# EasyEDA Pro project ECU_Project.epro, schematic ECU
Board Name: Embedded; Create Date: 2024-12-12; Page Name: Schematic; Project Name: ECU; Schematic Name: ECU; Update Date: 2025-01-06; Company: ProjectKita; Drawn: Yunus; Page Size: A2; Part Number: JLCPCB-002; Reviewed: Aris; Version: V1.2
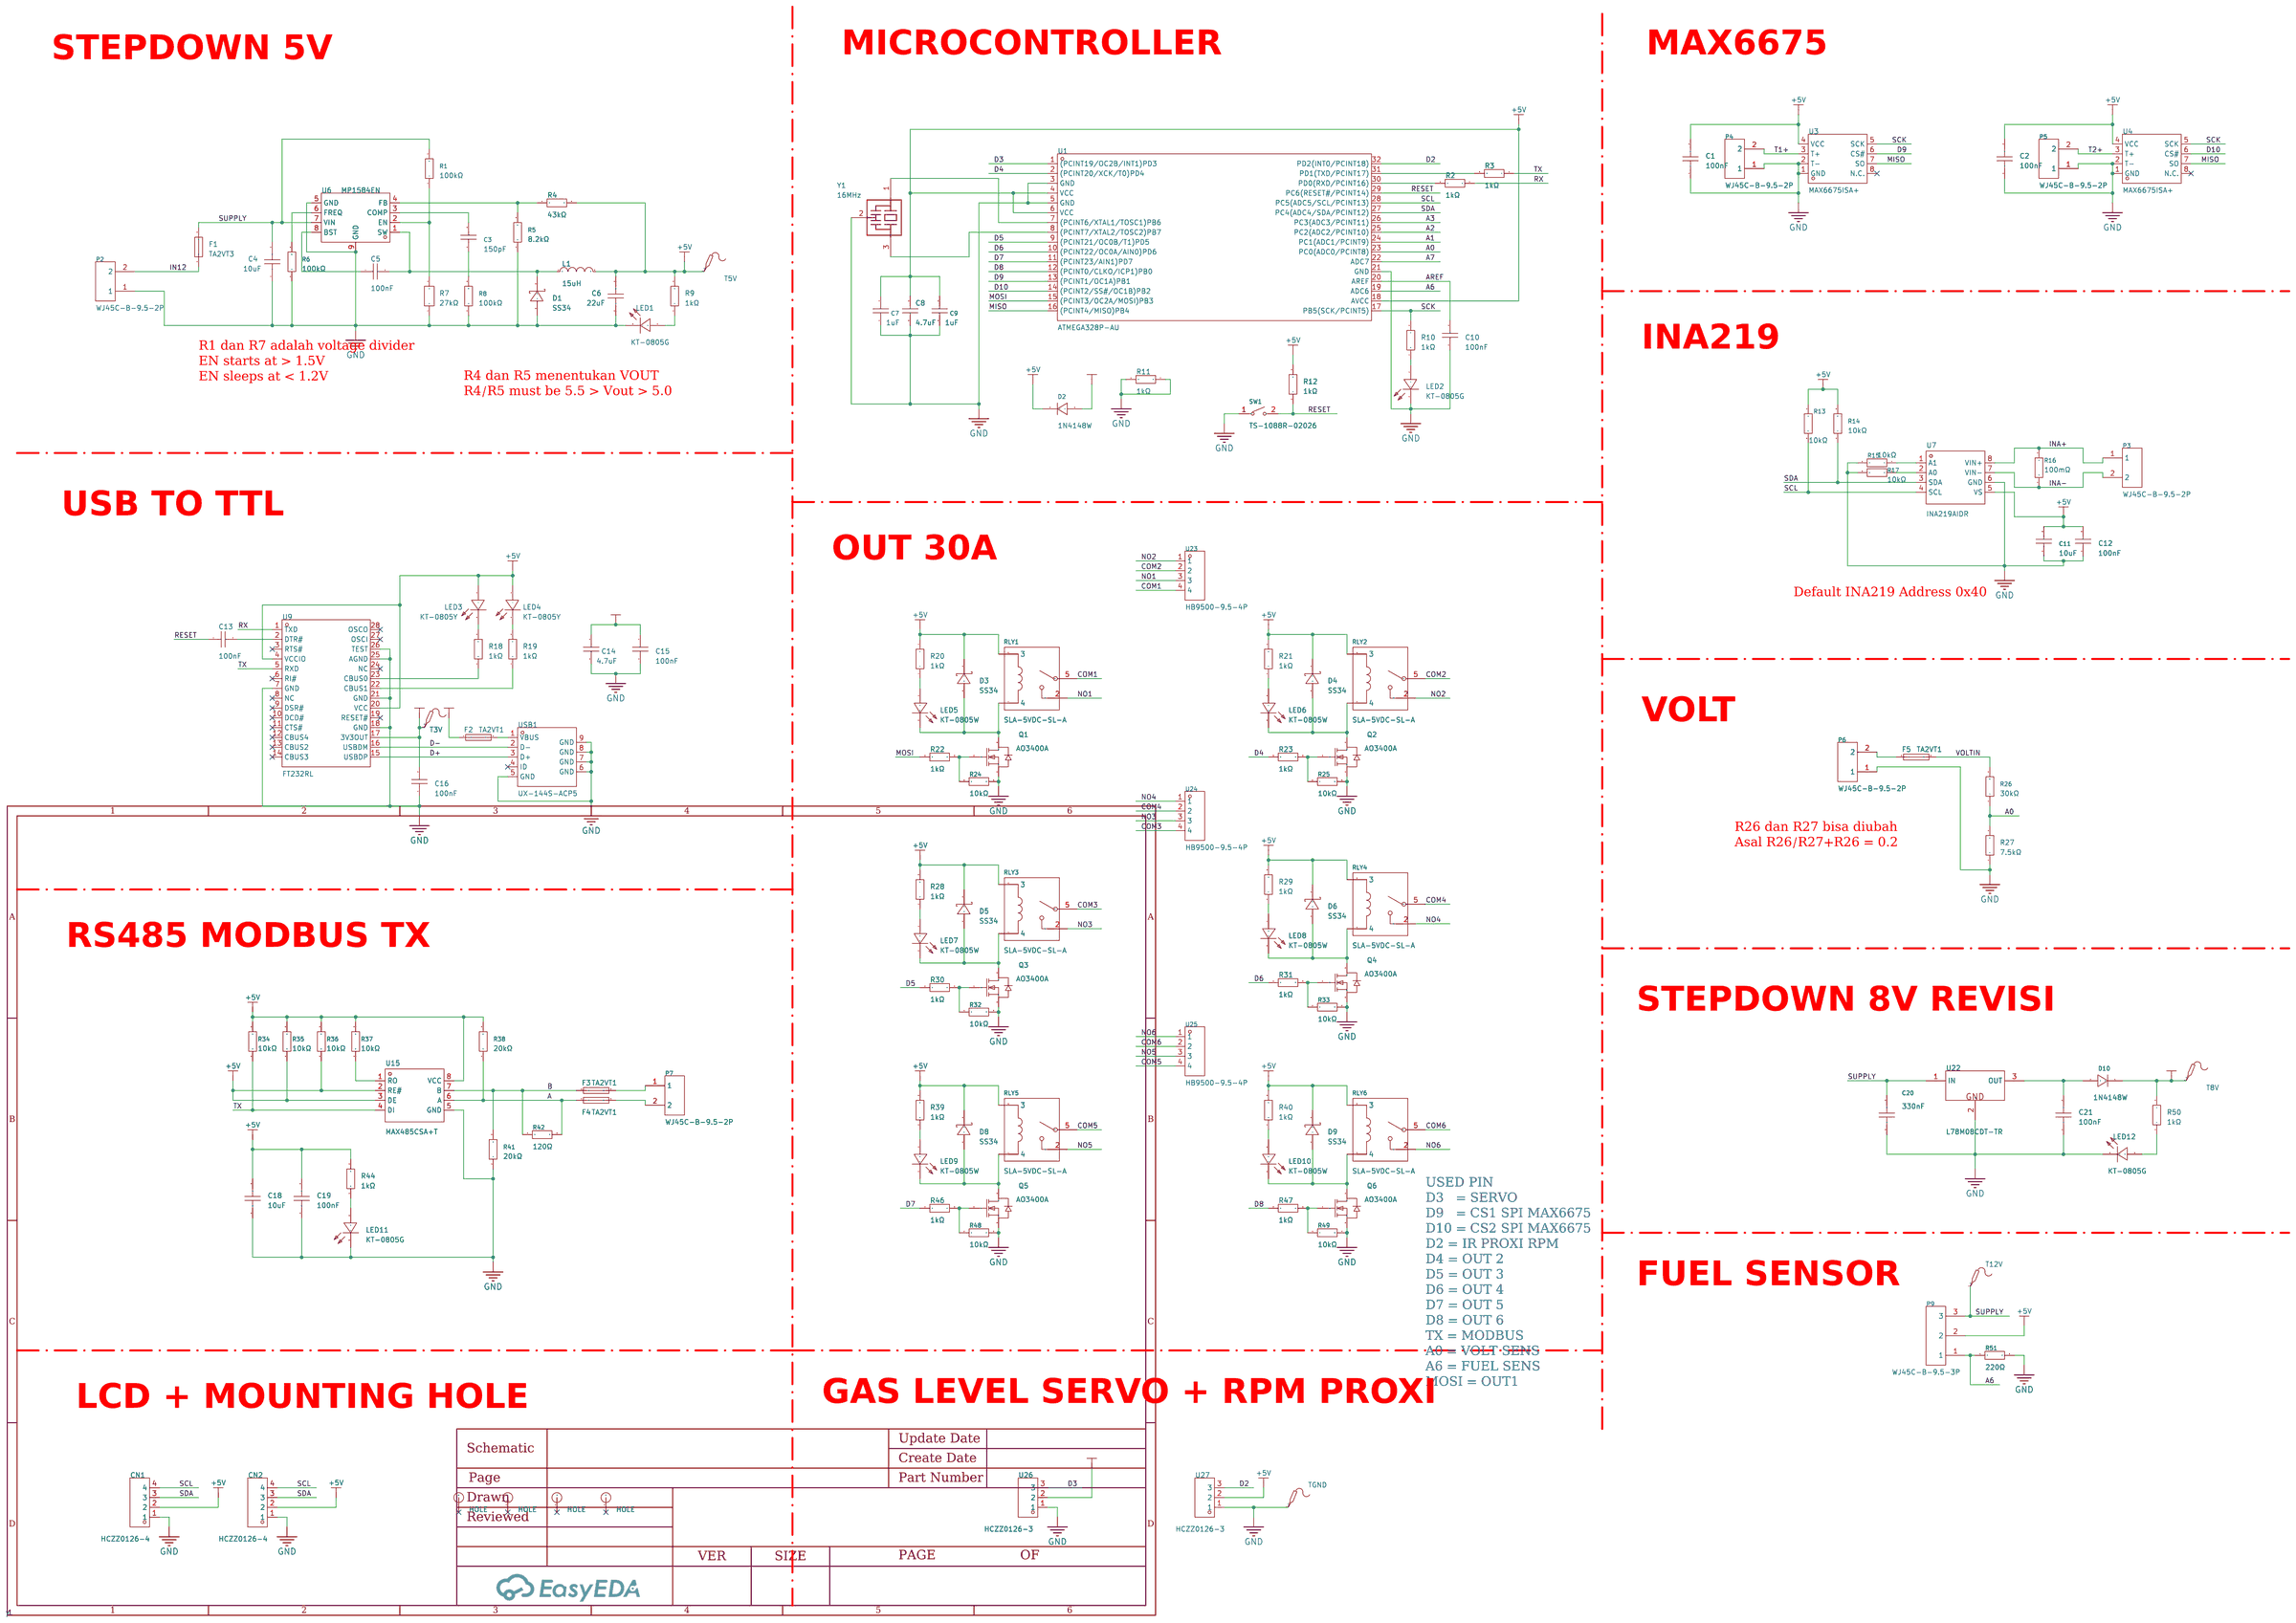
[diagram p0: schematic sheet]

## Parts
C1  100nF  [C0805]
C2  100nF  [C0805]
C3  150pF  [C0805]
C4  10uF  [C0805]
C5  100nF  [C0805]
C6  22uF  [C0805]
C7  1uF  [C0805]
C8  4.7uF  [C0805]
C9  1uF  [C0805]
C10  100nF  [C0805]
C11  10uF  [C0805]
C12  100nF  [C0805]
C13  100nF  [C0805]
C14  4.7uF  [C0805]
C15  100nF  [C0805]
C16  100nF  [C0805]
C18  10uF  [C0805]
C19  100nF  [C0805]
C20  330nF  [C0805]
C21  100nF  [C0805]
CN1  HCZZ0126-4  [CONN-TH_XH2.54-4P]
CN2  HCZZ0126-4  [CONN-TH_XH2.54-4P]
D1  SS34  [SMA_L4.3-W2.6-LS5.2-RD]
D2  1N4148W  [SOD-123F_L2.7-W1.6-LS3.8-RD]
D3  SS34  [SMA_L4.3-W2.6-LS5.2-RD]
D4  SS34  [SMA_L4.3-W2.6-LS5.2-RD]
D5  SS34  [SMA_L4.3-W2.6-LS5.2-RD]
D6  SS34  [SMA_L4.3-W2.6-LS5.2-RD]
D8  SS34  [SMA_L4.3-W2.6-LS5.2-RD]
D9  SS34  [SMA_L4.3-W2.6-LS5.2-RD]
D10  1N4148W  [SOD-123F_L2.7-W1.6-LS3.8-RD]
F1  TA2VT3  [FUSE-SMD_L6.1-W2.5]
F2  TA2VT1  [F2410]
F3  TA2VT1  [F2410]
F4  TA2VT1  [F2410]
F5  TA2VT1  [F2410]
J1  HOLE  [M2 Mounting Hole - Conductive]
J2  HOLE  [M2 Mounting Hole - Conductive]
J3  HOLE  [M2 Mounting Hole - Conductive]
J4  HOLE  [M2 Mounting Hole - Conductive]
L1  15uH  [IND-SMD_L7.0-W6.6_FXL0630]
LED1  KT-0805G  [LED0805-R-RD]
LED2  KT-0805G  [LED0805-R-RD]
LED3  KT-0805Y  [LED0805-R-RD]
LED4  KT-0805Y  [LED0805-R-RD]
LED5  KT-0805W  [LED0805-R-RD]
LED6  KT-0805W  [LED0805-R-RD]
LED7  KT-0805W  [LED0805-R-RD]
LED8  KT-0805W  [LED0805-R-RD]
LED9  KT-0805W  [LED0805-R-RD]
LED10  KT-0805W  [LED0805-R-RD]
LED11  KT-0805G  [LED0805-R-RD]
LED12  KT-0805G  [LED0805-R-RD]
P2  WJ45C-B-9.5-2P  [CONN-TH_2P-P9.50_WJ45C-B-2P]
P3  WJ45C-B-9.5-2P  [CONN-TH_2P-P9.50_WJ45C-B-2P]
P4  WJ45C-B-9.5-2P  [CONN-TH_2P-P9.50_WJ45C-B-2P]
P5  WJ45C-B-9.5-2P  [CONN-TH_2P-P9.50_WJ45C-B-2P]
P6  WJ45C-B-9.5-2P  [CONN-TH_2P-P9.50_WJ45C-B-2P]
P7  WJ45C-B-9.5-2P  [CONN-TH_2P-P9.50_WJ45C-B-2P]
P9  WJ45C-B-9.5-3P  [CONN-TH_3P-P9.50_WJ45C-B-3P]
Q1  AO3400A  [SOT-23-3_L2.9-W1.3-P1.90-LS2.4-BR]
Q2  AO3400A  [SOT-23-3_L2.9-W1.3-P1.90-LS2.4-BR]
Q3  AO3400A  [SOT-23-3_L2.9-W1.3-P1.90-LS2.4-BR]
Q4  AO3400A  [SOT-23-3_L2.9-W1.3-P1.90-LS2.4-BR]
Q5  AO3400A  [SOT-23-3_L2.9-W1.3-P1.90-LS2.4-BR]
Q6  AO3400A  [SOT-23-3_L2.9-W1.3-P1.90-LS2.4-BR]
R1  100kΩ  [R0805]
R2  1kΩ  [R0805]
R3  1kΩ  [R0805]
R4  43kΩ  [R0805]
R5  8.2kΩ  [R0805]
R6  100kΩ  [R0805]
R7  27kΩ  [R0805]
R8  100kΩ  [R0805]
R9  1kΩ  [R0805]
R10  1kΩ  [R0805]
R11  1kΩ  [R0805]
R12  1kΩ  [R0805]
R13  10kΩ  [R0805]
R14  10kΩ  [R0805]
R15  10kΩ  [R0805]
R16  100mΩ  [R1206]
R17  10kΩ  [R0805]
R18  1kΩ  [R0805]
R19  1kΩ  [R0805]
R20  1kΩ  [R0805]
R21  1kΩ  [R0805]
R22  1kΩ  [R0805]
R23  1kΩ  [R0805]
R24  10kΩ  [R0805]
R25  10kΩ  [R0805]
R26  30kΩ  [R0805]
R27  7.5kΩ  [R0805]
R28  1kΩ  [R0805]
R29  1kΩ  [R0805]
R30  1kΩ  [R0805]
R31  1kΩ  [R0805]
R32  10kΩ  [R0805]
R33  10kΩ  [R0805]
R34  10kΩ  [R0805]
R35  10kΩ  [R0805]
R36  10kΩ  [R0805]
R37  10kΩ  [R0805]
R38  20kΩ  [R0805]
R39  1kΩ  [R0805]
R40  1kΩ  [R0805]
R41  20kΩ  [R0805]
R42  120Ω  [R0805]
R44  1kΩ  [R0805]
R46  1kΩ  [R0805]
R47  1kΩ  [R0805]
R48  10kΩ  [R0805]
R49  10kΩ  [R0805]
R50  1kΩ  [R0805]
R51  220Ω  [R0805]
RLY1  SLA-5VDC-SL-A  [RELAY-TH_SLA-XXVDC-SL-A]
RLY2  SLA-5VDC-SL-A  [RELAY-TH_SLA-XXVDC-SL-A]
RLY3  SLA-5VDC-SL-A  [RELAY-TH_SLA-XXVDC-SL-A]
RLY4  SLA-5VDC-SL-A  [RELAY-TH_SLA-XXVDC-SL-A]
RLY5  SLA-5VDC-SL-A  [RELAY-TH_SLA-XXVDC-SL-A]
RLY6  SLA-5VDC-SL-A  [RELAY-TH_SLA-XXVDC-SL-A]
SW1  TS-1088R-02026  [SW-SMD_L3.9-W3.0-P4.45]
T3V  -  [Test-Point-0.5mm]
T5V  -  [Test-Point-0.5mm]
T8V  -  [Test-Point-0.5mm]
T12V  -  [Test-Point-0.5mm]
TGND  -  [Test-Point-0.5mm]
U1  ATMEGA328P-AU  [TQFP-32_L7.0-W7.0-P0.80-LS9.0-BL]
U3  MAX6675ISA+  [SOIC-8_L5.0-W4.0-P1.27-LS6.0-BL]
U4  MAX6675ISA+  [SOIC-8_L5.0-W4.0-P1.27-LS6.0-BL]
U6  MP1584EN  [SOIC-8_L4.9-W3.9-P1.27-LS6.0-BL-EP3.3]
U7  INA219AIDR  [SOIC-8_L4.9-W3.9-P1.27-LS6.0-BL]
U9  FT232RL  [SSOP-28_L10.2-W5.3-P0.65-LS7.8-BL]
U15  MAX485CSA+T  [SOIC-8_L4.9-W3.9-P1.27-LS6.0-BL]
U22  L78M08CDT-TR  [TO-252-2_L6.6-W6.1-P4.57-LS9.9-TL-CW]
U23  HB9500-9.5-4P  [CONN-TH_HB9500-9.5-4P]
U24  HB9500-9.5-4P  [CONN-TH_HB9500-9.5-4P]
U25  HB9500-9.5-4P  [CONN-TH_HB9500-9.5-4P]
U26  HCZZ0126-3  [CONN-TH_3P-P2.50_3PIN]
U27  HCZZ0126-3  [CONN-TH_3P-P2.50_3PIN]
USB1  UX-144S-ACP5  [MINI-USB-SMD_UX-144S-ACP5]
Y1  16MHz  [OSC-SMD_3P-L3.2-W1.3-P1.2-L]

## Library data of the parts
C1 C2 = CC0805KRX7R9BB104: Capacitance: Tolerance:±10% Tolerance:±10% Voltage Rated: Temperature Coefficient:; LCSC Part Name: 100nF ±10% 50V; Supplier Part: C49678; Manufacturer: YAGEO(国巨); Supplier Footprint: 0805; Datasheet: https://atta.szlcsc.com/upload/public/pdf/source/20180224/C181747_15194369449651363981.pdf; Supplier: LCSC; Tolerance: ±10%
C3 = CC0805JRNPO9BN151: Capacitance: Tolerance:±5% Tolerance:±5% Voltage Rated: Temperature Coefficient:; LCSC Part Name: 150pF ±5% 50V; Supplier Part: C107111; Manufacturer: YAGEO(国巨); Supplier Footprint: 0805; Datasheet: https://atta.szlcsc.com/upload/public/pdf/source/20170914/C128857_1505359892143968080.pdf; Supplier: LCSC; Tolerance: ±5%
C4 = CL21A106KBYQNNE: Capacitance: Tolerance:±10% Tolerance:±10% Voltage Rated: Temperature Coefficient:; LCSC Part Name: 10uF ±10% 50V; Supplier Part: C2932476; Manufacturer: SAMSUNG(三星); Supplier Footprint: 0805; JLCPCB Part Class: Extended Part; Datasheet: https://atta.szlcsc.com/upload/public/pdf/source/20211217/EA547804C3DC63CB0E92325AB8B6CF61.pdf; Supplier: LCSC; Tolerance: ±10%
C5 = CL21B104KBCNNNC: Capacitance: Tolerance:±10% Tolerance:±10% Voltage Rated: Temperature Coefficient:; LCSC Part Name: 100nF ±10% 50V; Supplier Part: C1711; Manufacturer: SAMSUNG(三星); Supplier Footprint: 0805; JLCPCB Part Class: Extended Part; Datasheet: https://atta.szlcsc.com/upload/public/pdf/source/20160218/1457707763339.pdf; Supplier: LCSC; Tolerance: ±10%
C6 = CL21A226MQQNNNE: Capacitance: Tolerance:±20% Tolerance:±20% Voltage Rated: Temperature Coefficient:; LCSC Part Name: 22uF ±20% 6.3V; Supplier Part: C5674; Manufacturer: SAMSUNG(三星); Supplier Footprint: 0805; JLCPCB Part Class: Extended Part; Datasheet: https://atta.szlcsc.com/upload/public/pdf/source/20160218/1457707763339.pdf; Supplier: LCSC; Tolerance: ±20%
C7 C9 = CL21B105KBFNNNE: Capacitance: Tolerance:±10% Tolerance:±10% Voltage Rated: Temperature Coefficient:; LCSC Part Name: 1uF ±10% 50V; Supplier Part: C28323; Manufacturer: SAMSUNG(三星); Supplier Footprint: 0805; JLCPCB Part Class: Basic Part; Datasheet: https://atta.szlcsc.com/upload/public/pdf/source/20160218/1457707763339.pdf; Supplier: LCSC; Tolerance: ±10%
C8 C14 = CL21B475KOFNNNE: Capacitance: Tolerance:±10% Tolerance:±10% Voltage Rated: Temperature Coefficient:; LCSC Part Name: 4.7uF ±10% 16V; Supplier Part: C107365; Manufacturer: SAMSUNG(三星); Supplier Footprint: 0805; JLCPCB Part Class: Extended Part; Datasheet: https://atta.szlcsc.com/upload/public/pdf/source/20160218/1457707763339.pdf; Supplier: LCSC; Tolerance: ±10%
C10 C12 C13 C15 C16 = CL21B104KCFNNNE: Capacitance: Tolerance:±10% Tolerance:±10% Voltage Rated: Temperature Coefficient:; LCSC Part Name: 100nF ±10% 100V; Supplier Part: C28233; Manufacturer: SAMSUNG(三星); Supplier Footprint: 0805; JLCPCB Part Class: Basic Part; Datasheet: https://atta.szlcsc.com/upload/public/pdf/source/20160218/1457707763339.pdf; Supplier: LCSC; Tolerance: ±10%
C11 = CL21A106KPFNNNE: Capacitance: Tolerance:±10% Tolerance:±10% Voltage Rated: Temperature Coefficient:; LCSC Part Name: 10uF ±10% 10V; Supplier Part: C17024; Manufacturer: SAMSUNG(三星); Supplier Footprint: 0805; Datasheet: https://atta.szlcsc.com/upload/public/pdf/source/20160218/1457707763339.pdf; Supplier: LCSC; Tolerance: ±10%
C18 = CL21A106KAYNNNE_C15850: Capacitance: Tolerance:±10% Tolerance:±10% Voltage Rated: Temperature Coefficient:; LCSC Part Name: 10uF ±10% 25V; Supplier Part: C15850; Manufacturer: SAMSUNG(三星); Manufacturer Part: CL21A106KAYNNNE; Supplier Footprint: 0805; JLCPCB Part Class: Basic Part; Datasheet: https://atta.szlcsc.com/upload/public/pdf/source/20160218/1457707763339.pdf; Supplier: LCSC; Tolerance: ±10%
C19 = CC0805KRX7R9BB104: Capacitance: Tolerance:±10% Tolerance:±10% Voltage Rated: Temperature Coefficient:; LCSC Part Name: 100nF ±10% 50V; Supplier Part: C49678; Manufacturer: YAGEO(国巨); Supplier Footprint: 0805; JLCPCB Part Class: Basic Part; Datasheet: https://atta.szlcsc.com/upload/public/pdf/source/20180224/C181747_15194369449651363981.pdf; Supplier: LCSC; Tolerance: ±10%
C20 = CL21B334KOCNNNC: Capacitance: Tolerance:±10% Tolerance:±10% Voltage Rated: Temperature Coefficient:; LCSC Part Name: 330nF ±10% 16V; Supplier Part: C318723; Manufacturer: SAMSUNG(三星); Supplier Footprint: 0805; Datasheet: https://atta.szlcsc.com/upload/public/pdf/source/20160218/1457707763339.pdf; Supplier: LCSC; Tolerance: ±10%
C21 = GRM21B7U1A104JA01L: Capacitance: Tolerance:±5% Tolerance:±5% Voltage Rated: Temperature Coefficient:; LCSC Part Name: 100nF ±5% 10V; Supplier Part: C710980; Manufacturer: muRata(村田); Supplier Footprint: 0805; Datasheet: https://atta.szlcsc.com/upload/public/pdf/source/20210128/C710980_BEF80F3D26E955AEFCD9E2DE324B32E9.pdf; Supplier: LCSC; Tolerance: ±5%
CN1 CN2 = HCZZ0126-4: Pins Structure:1x4P Pitch:2.54mm Mounting Style:Straight Reference Series:XH Number of Pins:4P Number of Rows:1 Number of PINs Per Row:4 Current Rating (Max):3A Contact Material:Brass Contact Plating:Tin Operating Temperature Range:-25℃~+85℃ Operating Tem; LCSC Part Name: 1x4P 间距:2.54mm 直插 系列:XH 米色; Supplier Part: C7433754; Manufacturer: HC(虹成电子); Supplier Footprint: 插件,p=2.54mm; Datasheet: https://atta.szlcsc.com/upload/public/pdf/source/20230707/95864C323290A0568648B2D8A0D96E5C.pdf; Supplier: LCSC; Pins Structure: 1x4P; Pitch: 2.54mm; Mounting Style: Straight; Reference Series: XH; Number of Pins: 4P; Number of Rows: 1; Number of PINs Per Row: 4; Current Rating (Max): 3A; Contact Material: Brass; Contact Plating: Tin; Operating Temperature Range: -25℃~+85℃
D1 D3-D6 D8 D9 = SS34_C8678: Diode Configuration:Independent Type Forward Voltage (Vf@If):550mV@3A Reverse Voltage (Vr):40V Rectified Current:3A Reverse Leakage Current (Ir):500uA@40V; LCSC Part Name: 电压:40V 电流:3A; Supplier Part: C8678; Manufacturer: MDD(辰达半导体); Supplier Footprint: SMA(DO-214AC); JLCPCB Part Class: Basic Part; Datasheet: https://atta.szlcsc.com/upload/public/pdf/source/20240710/2118BB86FDDB2E0B294389AC1F3F65C8.pdf; Supplier: LCSC; Diode Configuration: Independent Type; Forward Voltage (Vf@If): 550mV@3A; Reverse Voltage (Vr): 40V; Rectified Current: 3A; Reverse Leakage Current (Ir): 500uA@40V
D2 D10 = 1N4148W_C81598: Diode Configuration: Forward Voltage (Vf@If):1V@50mA Reverse Voltage (Vr): Average Rectified Current (Io): Power Dissipation: Reverse Leakage Current:1uA@75V Reverse Recovery Time (trr): Operating Temperature:- Operating Temperature:-; LCSC Part Name: 电压:75V 电流:150mA; Supplier Part: C81598; Manufacturer: ST(先科); Supplier Footprint: SOD-123; JLCPCB Part Class: Basic Part; Datasheet: https://atta.szlcsc.com/upload/public/pdf/source/20161024/1477288446905.pdf; Supplier: LCSC; Forward Voltage (Vf@If): 1V@50mA; Reverse Leakage Current: 1uA@75V
F1 = TA2VT3: Type:SMD Fuse Current Rating:3A Voltage Rating  (AC):250V; LCSC Part Name: 2410 慢断 3A 250V 镀金; Supplier Part: C3014121; Manufacturer: TLC(竞沃); Supplier Footprint: 2410; JLCPCB Part Class: Extended Part; Datasheet: https://atta.szlcsc.com/upload/public/pdf/source/20220520/442597D85C5DD0BE46CC46EDD38271F0.pdf; Supplier: LCSC; Type: SMD Fuse; Current Rating: 3A; Voltage Rating  (AC): 250V
F2-F5 = TA2VT1: LCSC Part Name: 2410 慢断 1A 250V 镀金; Supplier Part: C3014117; Manufacturer: TLC(竞沃); Supplier Footprint: 2410; JLCPCB Part Class: Extended Part; Datasheet: https://atta.szlcsc.com/upload/public/pdf/source/20220520/442597D85C5DD0BE46CC46EDD38271F0.pdf; Supplier: LCSC
J1-J4 = HOLE
L1 = FXL0630-150-M: Inductance: Tolerance:±20% Tolerance:±20% Rated Current:3A Saturation Current (Isat):4.5A DC Resistance (DCR): Type:Integrated molded inductor; LCSC Part Name: 15uH ±20% 4.5A; Supplier Part: C177243; Manufacturer: cjiang(长江微电); Supplier Footprint: SMD,6.6x7mm; Datasheet: https://atta.szlcsc.com/upload/public/pdf/source/20240426/3189EA8206330E2108542F9E34E540E7.pdf; Supplier: LCSC; Tolerance: ±20%; Rated Current: 3A; Saturation Current (Isat): 4.5A; Type: Integrated molded inductor
LED1 LED2 LED11 LED12 = KT-0805G: Lamp Holder Type:- Emitted Color:Emerald Forward Voltage (VF):- Forward Voltage (VF):- Power Dissipation:- Forward Current:- Dominant Wavelength:- Dominant Wavelength:- Peak Wavelength:- Diode Configuration:- Lens Color:- Color Temperature:- Color Tempera; LCSC Part Name: 0805 翠绿 高亮; Supplier Part: C2297; Manufacturer: KENTO; Supplier Footprint: 0805; JLCPCB Part Class: Basic Part; Datasheet: https://atta.szlcsc.com/upload/public/pdf/source/20170209/1486607340485.pdf; Supplier: LCSC; Emitted Color: Emerald
LED3 LED4 = KT-0805Y: Emitted Color:Yellow Power Dissipation:- Forward Current:- Dominant Wavelength:- Dominant Wavelength:- Peak Wavelength:- Diode Configuration:- Lens Color:- Color Temperature:- Color Temperature:- Viewing Angle:- Mounting Sytle:- Operating Temperature:- Op; LCSC Part Name: 0805 黄灯 高亮; Supplier Part: C2296; Manufacturer: KENTO; Supplier Footprint: 0805; JLCPCB Part Class: Basic Part; Datasheet: https://atta.szlcsc.com/upload/public/pdf/source/20160421/1461205044170.pdf; Supplier: LCSC; Emitted Color: Yellow
LED5-LED10 = KT-0805W: LCSC Part Name: 0805 白灯 高亮; Supplier Part: C34499; Manufacturer: KENTO; Supplier Footprint: 0805; JLCPCB Part Class: Basic Part; Datasheet: https://atta.szlcsc.com/upload/public/pdf/source/20221124/DAA20402FFC1FB071B8B6797757426FE.pdf; Supplier: LCSC
P2-P7 = WJ45C-B-9.5-2P: Barrier Type:两面 Pitch:9.5mm Structure:1x2P Mounting Style:直针 Pin Location:中脚 Number of Pins:2P Number of Rows:1 Current Rating (Max):32A Voltage Rating (Max):750V Wire Gauge - AWG:12~22 Wire Gauge - mm2:4 Operating Temperature Range:-40℃~+105℃ Operating T; LCSC Part Name: 9.5mm 1x2P 每排P数:2 排数:1 直针 中脚; Supplier Part: C8397; Manufacturer: KANGNEX(康奈克斯电气); Supplier Footprint: 插件,P=9.5mm; JLCPCB Part Class: Extended Part; Datasheet: https://atta.szlcsc.com/upload/public/pdf/source/20191225/C8397_C0B2C2E73138A510EBF0F13B91F71912.pdf; Supplier: LCSC; Barrier Type: 两面; Pitch: 9.5mm; Structure: 1x2P; Mounting Style: 直针; Pin Location: 中脚; Number of Pins: 2P; Number of Rows: 1; Current Rating (Max): 32A; Voltage Rating (Max): 750V; Wire Gauge - AWG: 12~22; Wire Gauge - mm2: 4; Operating Temperature Range: -40℃~+105℃; Color: Black; Number of PINs Per Row: 2
P9 = WJ45C-B-9.5-3P: Barrier Type:两面 Pitch:9.5mm Structure:1x3P Mounting Style:直针 Pin Location:中脚 Number of Pins:3P Number of Rows:1 Current Rating (Max):32A Voltage Rating (Max):750V Wire Gauge - AWG:12~22 Wire Gauge - mm2:4 Operating Temperature Range:-40℃~+105℃ Operating T; LCSC Part Name: 9.5mm 1x3P 每排P数:3 排数:1 直针 中脚; Supplier Part: C8442; Manufacturer: KANGNEX(康奈克斯电气); Supplier Footprint: 插件,P=9.5mm; JLCPCB Part Class: Extended Part; Datasheet: https://atta.szlcsc.com/upload/public/pdf/source/20191225/C8442_FBE59D2F29844B0ABF8A0A98E5C59968.pdf; Supplier: LCSC; Barrier Type: 两面; Pitch: 9.5mm; Structure: 1x3P; Mounting Style: 直针; Pin Location: 中脚; Number of Pins: 3P; Number of Rows: 1; Current Rating (Max): 32A; Voltage Rating (Max): 750V; Wire Gauge - AWG: 12~22; Wire Gauge - mm2: 4; Operating Temperature Range: -40℃~+105℃; Color: Black; Number of PINs Per Row: 3
Q1-Q6 = AO3400A_C20917: Type:1 N-Channel Drain Source Voltage (Vdss): Continuous Drain Current (Id): Drain Source On Resistance (RDS(on)@Vgs,Id):26.5mΩ@10V,5.7A Power Dissipation (Pd): Gate Threshold Voltage (Vgs(th)@Id):1.5V@250uA Total Gate Charge (Qg@Vgs):7nC@4.5V Input Capac; LCSC Part Name: 1个N沟道 耐压:30V 电流:5.7A; Supplier Part: C20917; Manufacturer: AOS; Supplier Footprint: SOT-23-3L; JLCPCB Part Class: Basic Part; Datasheet: https://atta.szlcsc.com/upload/public/pdf/source/20140107/1457706668533.pdf; Supplier: LCSC; Type: 1 N-Channel; Drain Source On Resistance (RDS(on)@Vgs,Id): 26.5mΩ@10V,5.7A; Gate Threshold Voltage (Vgs(th)@Id): 1.5V@250uA; Total Gate Charge (Qg@Vgs): 7nC@4.5V; Input Capacitance (Ciss@Vds): 630pF@15V; Operating Temperature: -55℃~+150℃@(Tj)
R1 R6 R8 = 0805W8F1003T5E: Type:Thick Film Resistors Resistance:100kΩ Tolerance:±1% Tolerance:±1% Power(Watts): Overload Voltage (Max): Temperature Coefficient:±100ppm/℃ Temperature Coefficient:±100ppm/℃ Operating Temperature Range:-55℃~+155℃ Operating Temperature Range:-55℃~+155℃; LCSC Part Name: 100kΩ ±1% 125mW 厚膜电阻; Supplier Part: C149504; Manufacturer: UNI-ROYAL(厚声); Supplier Footprint: 0805; JLCPCB Part Class: Basic Part; Datasheet: https://atta.szlcsc.com/upload/public/pdf/source/20200306/C422600_1E6D84923E4A46A82E41ADD87F860B5C.pdf; Supplier: LCSC; Type: Thick Film Resistors; Tolerance: ±1%; Temperature Coefficient: ±100ppm/℃; Operating Temperature Range: -55℃~+155℃
R2 R3 R9-R12 R18-R23 R28-R31 R39 R40 R44 R46 R47 R50 = 0805W8F1001T5E: Type:Thick Film Resistors Resistance:1kΩ Tolerance:±1% Tolerance:±1% Power(Watts): Overload Voltage (Max): Temperature Coefficient:±100ppm/℃ Temperature Coefficient:±100ppm/℃ Operating Temperature Range:-55℃~+155℃ Operating Temperature Range:-55℃~+155℃; LCSC Part Name: 1kΩ ±1% 125mW 厚膜电阻; Supplier Part: C17513; Manufacturer: UNI-ROYAL(厚声); Supplier Footprint: 0805; JLCPCB Part Class: Basic Part; Datasheet: https://atta.szlcsc.com/upload/public/pdf/source/20200306/C422600_1E6D84923E4A46A82E41ADD87F860B5C.pdf; Supplier: LCSC; Type: Thick Film Resistors; Tolerance: ±1%; Temperature Coefficient: ±100ppm/℃; Operating Temperature Range: -55℃~+155℃
R4 = 0805W8F4302T5E: Type:Thick Film Resistors Resistance:43kΩ Tolerance:±1% Tolerance:±1% Power(Watts): Overload Voltage (Max): Temperature Coefficient:±100ppm/℃ Temperature Coefficient:±100ppm/℃ Operating Temperature Range:-55℃~+155℃ Operating Temperature Range:-55℃~+155℃; LCSC Part Name: 43kΩ ±1% 125mW 厚膜电阻; Supplier Part: C17695; Manufacturer: UNI-ROYAL(厚声); Supplier Footprint: 0805; Datasheet: https://atta.szlcsc.com/upload/public/pdf/source/20200306/C422600_1E6D84923E4A46A82E41ADD87F860B5C.pdf; Supplier: LCSC; Type: Thick Film Resistors; Tolerance: ±1%; Temperature Coefficient: ±100ppm/℃; Operating Temperature Range: -55℃~+155℃
R5 = 0805W8F8201T5E: Type:Thick Film Resistors Resistance:8.2kΩ Tolerance:±1% Tolerance:±1% Power(Watts): Overload Voltage (Max): Temperature Coefficient:±100ppm/℃ Temperature Coefficient:±100ppm/℃ Operating Temperature Range:-55℃~+155℃ Operating Temperature Range:-55℃~+155℃; LCSC Part Name: 8.2kΩ ±1% 125mW 厚膜电阻; Supplier Part: C17828; Manufacturer: UNI-ROYAL(厚声); Supplier Footprint: 0805; Datasheet: https://atta.szlcsc.com/upload/public/pdf/source/20200306/C422600_1E6D84923E4A46A82E41ADD87F860B5C.pdf; Supplier: LCSC; Type: Thick Film Resistors; Tolerance: ±1%; Temperature Coefficient: ±100ppm/℃; Operating Temperature Range: -55℃~+155℃
R7 = FRC0805F2702TS: Type:Thick Film Resistors Resistance:27kΩ Tolerance:±1% Tolerance:±1% Power(Watts): Overload Voltage (Max): Temperature Coefficient:±100ppm/℃ Temperature Coefficient:±100ppm/℃ Operating Temperature Range:-55℃~+155℃ Operating Temperature Range:-55℃~+155℃; LCSC Part Name: 27kΩ ±1% 125mW 厚膜电阻; Supplier Part: C2907247; Manufacturer: FOJAN(富捷); Supplier Footprint: 0805; JLCPCB Part Class: Extended Part; Datasheet: https://atta.szlcsc.com/upload/public/pdf/source/20211221/925EC7D7225764EE0046F22065062C87.pdf; Supplier: LCSC; Type: Thick Film Resistors; Tolerance: ±1%; Temperature Coefficient: ±100ppm/℃; Operating Temperature Range: -55℃~+155℃
R13-R15 R17 R24 R25 R32-R37 R48 R49 = 0805W8F1002T5E: Type:Thick Film Resistors Resistance:10kΩ Tolerance:±1% Tolerance:±1% Power(Watts): Overload Voltage (Max): Temperature Coefficient:±100ppm/℃ Temperature Coefficient:±100ppm/℃ Operating Temperature Range:-55℃~+155℃ Operating Temperature Range:-55℃~+155℃; LCSC Part Name: 10kΩ ±1% 125mW 厚膜电阻; Supplier Part: C17414; Manufacturer: UNI-ROYAL(厚声); Supplier Footprint: 0805; JLCPCB Part Class: Basic Part; Datasheet: https://atta.szlcsc.com/upload/public/pdf/source/20200306/C422600_1E6D84923E4A46A82E41ADD87F860B5C.pdf; Supplier: LCSC; Type: Thick Film Resistors; Tolerance: ±1%; Temperature Coefficient: ±100ppm/℃; Operating Temperature Range: -55℃~+155℃
R16 = 1206W4F100LT5E: Type:Thick Film Resistors Resistance:100mΩ Tolerance:±1% Tolerance:±1% Power(Watts): Overload Voltage (Max): Temperature Coefficient:±800ppm/℃ Temperature Coefficient:±800ppm/℃ Operating Temperature Range:-55℃~+155℃ Operating Temperature Range:-55℃~+155℃; LCSC Part Name: 100mΩ ±1% 250mW 厚膜电阻; Supplier Part: C25334; Manufacturer: UNI-ROYAL(厚声); Supplier Footprint: 1206; JLCPCB Part Class: Basic Part; Datasheet: https://atta.szlcsc.com/upload/public/pdf/source/20200306/C422600_1E6D84923E4A46A82E41ADD87F860B5C.pdf; Supplier: LCSC; Type: Thick Film Resistors; Tolerance: ±1%; Temperature Coefficient: ±800ppm/℃; Operating Temperature Range: -55℃~+155℃
R26 = 0805W8F3002T5E: Type:Thick Film Resistors Resistance:30kΩ Tolerance:±1% Tolerance:±1% Power(Watts): Overload Voltage (Max): Temperature Coefficient:±100ppm/℃ Temperature Coefficient:±100ppm/℃ Operating Temperature Range:-55℃~+155℃ Operating Temperature Range:-55℃~+155℃; LCSC Part Name: 30kΩ ±1% 125mW 厚膜电阻; Supplier Part: C17621; Manufacturer: UNI-ROYAL(厚声); Supplier Footprint: 0805; Datasheet: https://atta.szlcsc.com/upload/public/pdf/source/20200306/C422600_1E6D84923E4A46A82E41ADD87F860B5C.pdf; Supplier: LCSC; Type: Thick Film Resistors; Tolerance: ±1%; Temperature Coefficient: ±100ppm/℃; Operating Temperature Range: -55℃~+155℃
R27 = 0805W8F7501T5E: Type:Thick Film Resistors Resistance:7.5kΩ Tolerance:±1% Tolerance:±1% Power(Watts): Overload Voltage (Max): Temperature Coefficient:±100ppm/℃ Temperature Coefficient:±100ppm/℃ Operating Temperature Range:-55℃~+155℃ Operating Temperature Range:-55℃~+155℃; LCSC Part Name: 7.5kΩ ±1% 125mW 厚膜电阻; Supplier Part: C17807; Manufacturer: UNI-ROYAL(厚声); Supplier Footprint: 0805; JLCPCB Part Class: Extended Part; Datasheet: https://atta.szlcsc.com/upload/public/pdf/source/20200306/C422600_1E6D84923E4A46A82E41ADD87F860B5C.pdf; Supplier: LCSC; Type: Thick Film Resistors; Tolerance: ±1%; Temperature Coefficient: ±100ppm/℃; Operating Temperature Range: -55℃~+155℃
R38 R41 = 0805W8F2002T5E: Type:Thick Film Resistors Resistance:20kΩ Tolerance:±1% Tolerance:±1% Power(Watts): Overload Voltage (Max): Temperature Coefficient:±100ppm/℃ Temperature Coefficient:±100ppm/℃ Operating Temperature Range:-55℃~+155℃ Operating Temperature Range:-55℃~+155℃; LCSC Part Name: 20kΩ ±1% 125mW 厚膜电阻; Supplier Part: C4328; Manufacturer: UNI-ROYAL(厚声); Supplier Footprint: 0805; JLCPCB Part Class: Basic Part; Datasheet: https://atta.szlcsc.com/upload/public/pdf/source/20200306/C422600_1E6D84923E4A46A82E41ADD87F860B5C.pdf; Supplier: LCSC; Type: Thick Film Resistors; Tolerance: ±1%; Temperature Coefficient: ±100ppm/℃; Operating Temperature Range: -55℃~+155℃
R42 = 0805W8F1200T5E: Type:Thick Film Resistors Resistance: Tolerance:±1% Tolerance:±1% Power(Watts): Overload Voltage (Max): Temperature Coefficient:±100ppm/℃ Temperature Coefficient:±100ppm/℃ Operating Temperature Range:-55℃~+155℃ Operating Temperature Range:-55℃~+155℃; LCSC Part Name: 120Ω ±1% 125mW 厚膜电阻; Supplier Part: C17437; Manufacturer: UNI-ROYAL(厚声); Supplier Footprint: 0805; JLCPCB Part Class: Basic Part; Datasheet: https://atta.szlcsc.com/upload/public/pdf/source/20200306/C422600_1E6D84923E4A46A82E41ADD87F860B5C.pdf; Supplier: LCSC; Type: Thick Film Resistors; Tolerance: ±1%; Temperature Coefficient: ±100ppm/℃; Operating Temperature Range: -55℃~+155℃
R51 = 0805W8F2200T5E: Type:Thick Film Resistors Resistance: Tolerance:±1% Tolerance:±1% Power(Watts): Overload Voltage (Max): Temperature Coefficient:±100ppm/℃ Temperature Coefficient:±100ppm/℃ Operating Temperature Range:-55℃~+155℃ Operating Temperature Range:-55℃~+155℃; LCSC Part Name: 220Ω ±1% 125mW 厚膜电阻; Supplier Part: C17557; Manufacturer: UNI-ROYAL(厚声); Supplier Footprint: 0805; JLCPCB Part Class: Basic Part; Datasheet: https://atta.szlcsc.com/upload/public/pdf/source/20200306/C422600_1E6D84923E4A46A82E41ADD87F860B5C.pdf; Supplier: LCSC; Type: Thick Film Resistors; Tolerance: ±1%; Temperature Coefficient: ±100ppm/℃; Operating Temperature Range: -55℃~+155℃
RLY1-RLY6 = SLA-5VDC-SL-A_C87363: Coil Voltage:5V Contact Form:一组常开:1A(SPST-常开) Pin Number:4 Contact Rating:- Maximum Switching Voltage:250V@AC Coil Rated Power:900mW Maximum Switching Current:30A Coil Type:无极性-单线圈 Coil Resistance:27Ω Contact Resistance:100mΩ Operate Time:10ms Release Tim; LCSC Part Name: 蓝色; Supplier Part: C87363; Manufacturer: 松乐; Supplier Footprint: 插件,27.6x32mm; JLCPCB Part Class: Extended Part; Supplier: LCSC; Coil Voltage: 5V; Contact Form: 一组常开:1A(SPST-常开); Pin Number: 4; Maximum Switching Voltage: 250V@AC; Coil Rated Power: 900mW; Maximum Switching Current: 30A; Coil Type: 无极性-单线圈; Coil Resistance: 27Ω; Contact Resistance: 100mΩ; Operate Time: 10ms; Release Time: 10ms
SW1 = TS-1088R-02026: Circuit:SPST Actuator Style:Round Button Mounting Style:Brick nogging Switch Length:3.9mm Switch Width:2.93mm Switch Height:2mm Contact Current:50mA Voltage Rating (DC):12V With Lamp:- Mechanical Life:-; LCSC Part Name: 3.9*2.93*2mm 立贴 轻触开关; Supplier Part: C455280; Manufacturer: XUNPU(讯普); Supplier Footprint: SMD,3x4mm; JLCPCB Part Class: Extended Part; Datasheet: https://atta.szlcsc.com/upload/public/pdf/source/20191118/C455281_EC5379764BC1462550DF64BBBFEA9579.pdf; Supplier: LCSC; Circuit: SPST; Actuator Style: Round Button; Mounting Style: Brick nogging; Switch Length: 3.9mm; Switch Width: 2.93mm; Switch Height: 2mm; Contact Current: 50mA; Voltage Rating (DC): 12V
T3V T5V T8V T12V TGND = Test-Point: Test Point 测试点
U1 = ATMEGA328P-AU: Supplier Part: C2851158; Supplier Footprint: TQFP-32(7x7); JLCPCB Part Class: Extended Part; Supplier: LCSC
U3 U4 = MAX6675ISA+: Interface:SPI Supply Voltage:3V~5.5V Supply Voltage:3V~5.5V Operating Temperature:-20℃~+85℃ Operating Temperature:-20℃~+85℃; LCSC Part Name: 冷端补偿K型热电偶数字转换器 (0°C至+1024°C); Supplier Part: C17403562; Manufacturer: ADI(亚德诺)/MAXIM(美信); Supplier Footprint: SOIC-8; Supplier: LCSC; Interface: SPI; Supply Voltage: 3V~5.5V; Operating Temperature: -20℃~+85℃
U6 = MP1584EN: Supplier Part: C454188; Supplier Footprint: SOIC-8-EP; JLCPCB Part Class: Extended Part; Supplier: LCSC
U7 = INA219AIDR: LCSC Part Name: 零漂移双向电流/功率监测器带I2C接口; Supplier Part: C138706; Manufacturer: TI(德州仪器); Supplier Footprint: SOIC-8; Datasheet: https://www.ti.com/cn/lit/gpn/ina219; Supplier: LCSC
U9 = FT232RL: Applications Function: Protocol:; Supplier Part: C490691; Manufacturer: FTDI(飞特帝亚); Supplier Footprint: SSOP-28-208mil; JLCPCB Part Class: Extended Part; Datasheet: https://atta.szlcsc.com/upload/public/pdf/source/20200318/C490691_690E4DF63E1AFF9F26AE376DE8985AE3.pdf; Supplier: LCSC
U15 = MAX485CSA+T: Types:Transceiver Number of Driver:1 Number of receiver:1 Supply Voltage:4.75V~5.25V Supply Voltage:4.75V~5.25V Data Rate:2.5Mbps Data Rate:2.5Mbps Operating Temperature:0℃~+70℃ Operating Temperature:0℃~+70℃; LCSC Part Name: 低功耗、限摆率、RS-485/RS-422收发器; Supplier Part: C9945; Manufacturer: ADI(亚德诺)/MAXIM(美信); Supplier Footprint: SOIC-8; Datasheet: https://atta.szlcsc.com/upload/public/pdf/source/20121117/1457706559654.pdf; Supplier: LCSC; Types: Transceiver; Number of Driver: 1; Number of receiver: 1; Supply Voltage: 4.75V~5.25V; Data Rate: 2.5Mbps; Operating Temperature: 0℃~+70℃
U22 = L78M08CDT-TR: Output Type:Fixed Maximum Input Voltage:35V Output Voltage:8V Output Voltage:8V Output Current:500mA Power Supply Rejection Ratio (PSRR):56dB@(120Hz) Dropout Voltage:- standby current:6mA Feature:Short-Circuit  Protection；Thermal Protection(TSD) Operating; LCSC Part Name: 精密500 mA稳压器; Supplier Part: C158076; Manufacturer: ST(意法半导体); Supplier Footprint: TO-252-2(DPAK); JLCPCB Part Class: Extended Part; Datasheet: https://atta.szlcsc.com/upload/public/pdf/source/20181022/C283462_787B94D88A5EB1E3D8A6C9A20D29C77C.pdf; Supplier: LCSC; Output Type: Fixed; Maximum Input Voltage: 35V; Output Voltage: 8V; Output Current: 500mA; Power Supply Rejection Ratio (PSRR): 56dB@(120Hz); standby current: 6mA; Feature: Short-Circuit  Protection；Thermal Protection(TSD); Operating Temperature: 0℃~+125℃; Output Polarity: Positive electrode; Number of Outputs: 1
U23-U25 = HB9500-9.5-4P: Barrier Type:三面 Pitch:9.5mm Structure:1x4P Mounting Style:直针 Pin Location:边脚 Number of Pins:4P Number of Rows:1 Current Rating (Max):32A Voltage Rating (Max):750V Wire Gauge - AWG:10~18 Wire Gauge - mm2:4 Operating Temperature Range:-40℃~+105℃ Operating T; LCSC Part Name: 9.5mm 1x4P 每排P数:4 排数:1 直针 边脚; Supplier Part: C707838; Manufacturer: KEFA(科发); Supplier Footprint: 插件,P=9.5mm; JLCPCB Part Class: Extended Part; Datasheet: https://atta.szlcsc.com/upload/public/pdf/source/20230331/5873E5542BF93058E17D8678A7A76DA1.pdf; Supplier: LCSC; Barrier Type: 三面; Pitch: 9.5mm; Structure: 1x4P; Mounting Style: 直针; Pin Location: 边脚; Number of Pins: 4P; Number of Rows: 1; Current Rating (Max): 32A; Voltage Rating (Max): 750V; Wire Gauge - AWG: 10~18; Wire Gauge - mm2: 4; Operating Temperature Range: -40℃~+105℃; Color: Black; Number of PINs Per Row: 4
U26 U27 = HCZZ0126-3: Pins Structure:1x3P Pitch:2.54mm Mounting Style:Straight Reference Series:XH Number of Pins:3P Number of Rows:1 Number of PINs Per Row:3 Current Rating (Max):3A Contact Material:Brass Contact Plating:Tin Operating Temperature Range:-25℃~+85℃ Operating Tem; LCSC Part Name: 1x3P 间距:2.54mm 直插 系列:XH 米色; Supplier Part: C7433753; Manufacturer: HC(虹成电子); Supplier Footprint: 插件,p=2.54mm; JLCPCB Part Class: Extended Part; Datasheet: https://atta.szlcsc.com/upload/public/pdf/source/20230707/5BA1D5BA8108B3866C01EAB592CAE285.pdf; Supplier: LCSC; Pins Structure: 1x3P; Pitch: 2.54mm; Mounting Style: Straight; Reference Series: XH; Number of Pins: 3P; Number of Rows: 1; Number of PINs Per Row: 3; Current Rating (Max): 3A; Contact Material: Brass; Contact Plating: Tin; Operating Temperature Range: -25℃~+85℃
USB1 = UX-144S-ACP5: Connector Type:Mini-B Standard:USB 2.0 Gender:Female Mounting Style:卧贴 Number of Contacts:5P Number of Ports:1 Current Rating - Power (Max):1.5A Operating Temperature Range:-20℃~+70℃ Operating Temperature Range:-20℃~+70℃ Soldering Temperature(Max):260℃; LCSC Part Name: Mini-B 母 卧贴; Supplier Part: C720611; Manufacturer: XUNPU(讯普); Supplier Footprint: SMD; JLCPCB Part Class: Extended Part; Datasheet: https://atta.szlcsc.com/upload/public/pdf/source/20200812/C720611_E8490E4C4B00597353DD684194E98629.pdf; Supplier: LCSC; Connector Type: Mini-B; Standard: USB 2.0; Gender: Female; Mounting Style: 卧贴; Number of Contacts: 5P; Number of Ports: 1; Current Rating - Power (Max): 1.5A; Operating Temperature Range: -20℃~+70℃; Soldering Temperature(Max): 260℃
Y1 = 16MHz: LCSC Part Name: 16MHz ±0.5% 内置负载电容:15pF; Supplier Part: C91585; Manufacturer: muRata(村田); Manufacturer Part: CSTCE16M0V53Z-R0; Supplier Footprint: SMD3213-3P; Datasheet: https://atta.szlcsc.com/upload/public/pdf/source/20161226/1482720170907.pdf; Supplier: LCSC; Operating Temperature: -40℃~+125℃; Check: true

## Nets
+3.3V: C16.2 T3V.1 U9.17(3V3OUT)
+5V: C1.2 C2.2 C6.2 C7.2 C8.2 C9.2 C11.2 C12.2 C18.2 C19.2 CN1.2 CN2.2 D2.1(K) D3.1(K) D4.1(K) D5.1(K) D6.1(K) D8.1(K) D9.1(K) L1.2 LED3.1(+) LED4.1(+) P9.2 R4.2 R9.2 R12.2 R13.1 R14.2 R20.2 R21.2 R28.2 R29.2 R34.2 R35.1 R35.2 R36.1 R36.2 R37.2 R38.2 R39.2 R40.2 R44.2 RLY1.3 RLY2.3 RLY3.3 RLY4.3 RLY5.3 RLY6.3 T5V.1 U1.4(VCC) U1.6(VCC) U1.18(AVCC) U3.4(VCC) U4.4(VCC) U7.5(VS) U9.4(VCCIO) U9.20(VCC) U15.2(RE#) U15.3(DE) U15.8(VCC) U27.2
+8V: D10.1(K) R50.2 T8V.1 U26.2
GND: C1.1 C2.1 C4.1 C6.1 C7.1 C8.1 C9.1 C10.1 C11.1 C12.1 C14.1 C15.1 C16.1 C18.1 C19.1 C20.1 C21.1 CN1.1 CN2.1 D1.2(A) LED1.2(K) LED2.2(K) LED11.2(K) LED12.2(K) P2.1 P4.1 P5.1 P6.1 Q1.2(S) Q2.2(S) Q3.2(S) Q4.2(S) Q5.2(S) Q6.2(S) R5.1 R6.1 R7.1 R8.1 R11.1 R11.2 R15.2 R17.2 R24.2 R25.2 R27.1 R32.2 R33.2 R41.1 R48.2 R49.2 R51.2 SW1.1 TGND.1 U1.3(GND) U1.5(GND) U1.21(GND) U3.1(GND) U3.2(T-) U4.1(GND) U4.2(T-) U6.5(GND) U6.9(GND) U7.6(GND) U9.7(GND) U9.18(GND) U9.21(GND) U9.25(AGND) U9.26(TEST) U15.5(GND) U22.2(GND) U26.1 U27.1 USB1.5(GND) USB1.6(GND) USB1.7(GND) USB1.8(GND) USB1.9(GND) Y1.2(VSS)
A: F4.1 R38.1 R42.2 U15.6(A)
A0: R26.1 R27.2 U1.23(PC0(ADC0/PCINT8))
A1: U1.24(PC1(ADC1/PCINT9))
A2: U1.25(PC2(ADC2/PCINT10))
A3: U1.26(PC3(ADC3/PCINT11))
A6: P9.1 R51.1 U1.19(ADC6)
A7: U1.22(ADC7)
AREF: C10.2 U1.20(AREF)
B: F3.1 R41.2 R42.1 U15.7(B)
COM1: RLY1.5 U23.4
COM2: RLY2.5 U23.2
COM3: RLY3.5 U24.4
COM4: RLY4.5 U24.2
COM5: RLY5.5 U25.4
COM6: RLY6.5 U25.2
D2: U1.32(PD2(INT0/PCINT18)) U27.3
D3: U1.1((PCINT19/OC2B/INT1)PD3) U26.3
D4: R23.1 U1.2((PCINT20/XCK/T0)PD4)
D5: R30.1 U1.9((PCINT21/OC0B/T1)PD5)
D6: R31.1 U1.10((PCINT22/OC0A/AIN0)PD6)
D7: R46.1 U1.11((PCINT23/AIN1)PD7)
D8: R47.1 U1.12((PCINT0/CLKO/ICP1)PB0)
D9: U1.13((PCINT1/OC1A)PB1) U3.6(CS#)
D10: U1.14((PCINT2/SS#/OC1B)PB2) U4.6(CS#)
D+: U9.15(USBDP) USB1.3(D+)
D-: U9.16(USBDM) USB1.2(D-)
IN12: F1.1 P2.2
INA+: P3.1 R16.2 U7.8(VIN+)
INA-: P3.2 R16.1 U7.7(VIN-)
MISO: U1.16((PCINT4/MISO)PB4) U3.7(SO) U4.7(SO)
MOSI: R22.1 U1.15((PCINT3/OC2A/MOSI)PB3)
NO1: RLY1.2 U23.3
NO2: RLY2.2 U23.1
NO3: RLY3.2 U24.3
NO4: RLY4.2 U24.1
NO5: RLY5.2 U25.3
NO6: RLY6.2 U25.1
RESET: C13.1 R12.1 SW1.2 U1.29(PC6(RESET#/PCINT14))
RX: R2.1 U9.1(TXD)
SCK: R10.2 U1.17(PB5(SCK/PCINT5)) U3.5(SCK) U4.5(SCK)
SCL: CN1.4 CN2.4 R13.2 U1.28(PC5(ADC5/SCL/PCINT13)) U7.4(SCL)
SDA: CN1.3 CN2.3 R14.1 U1.27(PC4(ADC4/SDA/PCINT12)) U7.3(SDA)
SUPPLY: C4.2 C20.2 F1.2 P9.3 R1.2 T12V.1 U6.7(VIN) U22.1(IN)
T1+: P4.2 U3.3(T+)
T2+: P5.2 U4.3(T+)
TX: R3.1 R34.1 U9.5(RXD) U15.4(DI)
VOLTIN: F5.2 R26.2
VUSB: C14.2 C15.2 D2.2(A) F2.1
$1N730: R1.1 R7.2 U6.2(EN)
$1N855: R6.2 U6.6(FREQ)
$1N908: C5.2 D1.1(K) L1.1 U6.1(SW)
$1N914: C5.1 U6.8(BST)
$1N1025: C3.2 U6.3(COMP)
$1N1104: C3.1 R8.2
$1N1311: R4.1 R5.2 U6.4(FB)
$1N1843: LED1.1(A) R9.1
$1N2823: F2.2 USB1.1(VBUS)
$1N3355: LED3.2(-) R18.2
$1N3359: LED4.2(-) R19.2
$1N3364: R18.1 U9.23(CBUS0)
$1N3369: R19.1 U9.22(CBUS1)
$1N3507: C13.2 U9.2(DTR#)
$1N4715: LED2.1(A) R10.1
$1N5069: R2.2 U1.30(PD0(RXD/PCINT16))
$1N5110: R3.2 U1.31(PD1(TXD/PCINT17))
$1N5823: U1.7((PCINT6/XTAL1/TOSC1)PB6) Y1.1
$1N5832: U1.8((PCINT7/XTAL2/TOSC2)PB7) Y1.3
$1N9594: R17.1 U7.2(A0)
$1N9598: R15.1 U7.1(A1)
$1N11065: LED11.1(A) R44.1
$1N11066: R37.1 U15.1(RO)
$1N11468: D3.2(A) LED5.2(K) Q1.3(D) RLY1.4
$1N11469: Q1.1(G) R22.2 R24.1
$1N11471: LED5.1(A) R20.1
$1N14052: D4.2(A) LED6.2(K) Q2.3(D) RLY2.4
$1N14059: Q2.1(G) R23.2 R25.1
$1N14060: LED6.1(A) R21.1
$1N14396: D5.2(A) LED7.2(K) Q3.3(D) RLY3.4
$1N14403: Q3.1(G) R30.2 R32.1
$1N14404: LED7.1(A) R28.1
$1N14740: D6.2(A) LED8.2(K) Q4.3(D) RLY4.4
$1N14747: Q4.1(G) R31.2 R33.1
$1N14748: LED8.1(A) R29.1
$1N15084: D8.2(A) LED9.2(K) Q5.3(D) RLY5.4
$1N15091: Q5.1(G) R46.2 R48.1
$1N15092: LED9.1(A) R39.1
$1N15428: D9.2(A) LED10.2(K) Q6.3(D) RLY6.4
$1N15435: Q6.1(G) R47.2 R49.1
$1N15436: LED10.1(A) R40.1
$1N20099: F3.2 P7.1
$1N20103: F4.2 P7.2
$1N20325: F5.1 P6.2
$1N32249: C21.2 D10.2(A) U22.3(OUT)
$1N32659: LED12.1(A) R50.1

Not connected (* = marked no-connect by the designer): J1 1(P1)*; J2 1(P1)*; J3 1(P1)*; J4 1(P1)*; U3 8(N.C.)*; U4 8(N.C.)*; U9 3(RTS#)* 6(RI#)* 8(NC)* 9(DSR#)* 10(DCD#)* 11(CTS#)* 12(CBUS4)* 13(CBUS2)* 14(CBUS3)* 19(RESET#)* 24(NC)* 27(OSCI)* 28(OSCO)*; USB1 4(ID)*

## Notes on the sheet
- MICROCONTROLLER
- MAX6675
- STEPDOWN 5V
- INA219
- R1 dan R7 adalah voltage divider
  EN starts at > 1.5V
  EN sleeps at < 1.2V
- R4 dan R5 menentukan VOUT
  R4/R5 must be 5.5 > Vout > 5.0
- USB TO TTL
- OUT 30A
- Default INA219 Address 0x40
- VOLT
- R26 dan R27 bisa diubah
  Asal R26/R27+R26 = 0.2
- RS485 MODBUS TX
- STEPDOWN 8V REVISI
- FUEL SENSOR
- USED PIN
  D3   = SERVO
  D9   = CS1 SPI MAX6675
  D10 = CS2 SPI MAX6675
  D2 = IR PROXI RPM
  D4 = OUT 2
  D5 = OUT 3
  D6 = OUT 4
  D7 = OUT 5
  D8 = OUT 6
  TX = MODBUS
  A0 = VOLT SENS
  A6 = FUEL SENS
  MOSI = OUT1
- GAS LEVEL SERVO + RPM PROXI
- LCD + MOUNTING HOLE
